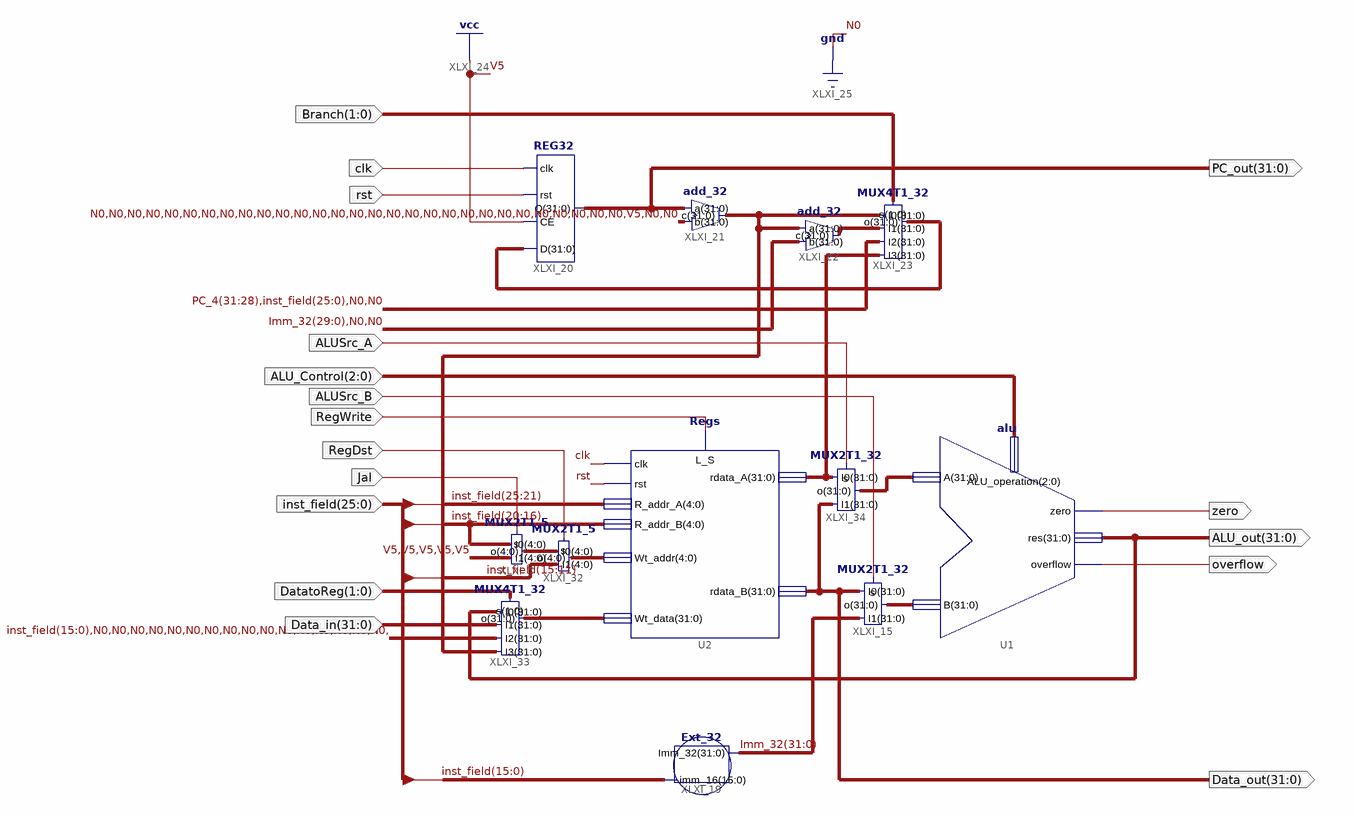
[diagram p0: schematic sheet 1]
// Xilinx ISE schematic Data_path_more.sch (kintex7) as structural Verilog: 12 symbols, 17 ports
module Data_path_more (
  input  [1:0] Branch,
  input  clk,
  input  rst,
  input  [2:0] ALU_Control,
  input  ALUSrc_B,
  input  RegWrite,
  input  Jal,
  input  [1:0] DatatoReg,
  input  [25:0] inst_field,
  input  [31:0] Data_in,
  input  RegDst,
  input  ALUSrc_A,
  output [31:0] PC_out,
  output [31:0] ALU_out,
  output [31:0] Data_out,
  output zero,
  output overflow
);

  wire [4:0] rt, Wt_addr;
  wire [31:0] ALU_A, ALU_B, branch_pc, Imm_32, next_pc, PC_4, rdata_A, WriteDATA;

  REG32 XLXI_20 (.D(next_pc), .CE(1'b1), .rst(rst), .clk(clk), .Q(PC_out));
  add_32 XLXI_21 (.c(PC_4), .a(PC_out), .b(32'b00000000000000000000000000000100));
  MUX4T1_32 XLXI_23 (
    .s(Branch), .I0(PC_4), .I1(branch_pc), .I2({PC_4[31:28], inst_field, 2'b00}), .I3(rdata_A), .o(next_pc));
  add_32 XLXI_22 (.c(branch_pc), .a(PC_4), .b({Imm_32[29:0], 2'b00}));
  alu U1 (.zero(zero), .res(ALU_out), .overflow(overflow), .A(ALU_A), .B(ALU_B), .ALU_operation(ALU_Control));
  Regs U2 (
    .clk(clk), .L_S(RegWrite), .rdata_A(rdata_A), .rst(rst), .Wt_data(WriteDATA), .rdata_B(Data_out),
    .R_addr_A(inst_field[25:21]), .R_addr_B(inst_field[20:16]), .Wt_addr(Wt_addr));
  MUX2T1_32 XLXI_15 (.s(ALUSrc_B), .I0(Data_out), .I1(Imm_32), .o(ALU_B));
  Ext_32 XLXI_19 (.imm_16(inst_field[15:0]), .Imm_32(Imm_32));
  MUX2T1_5 XLXI_3 (.I1({5{1'b1}}), .I0(inst_field[20:16]), .o(rt), .s(Jal));
  MUX2T1_5 XLXI_32 (.I1(inst_field[15:11]), .I0(rt), .o(Wt_addr), .s(RegDst));
  MUX4T1_32 XLXI_33 (
    .s(DatatoReg), .I0(ALU_out), .I1(Data_in), .I2({inst_field[15:0], {16{1'b0}}}), .I3(PC_4), .o(WriteDATA));
  MUX2T1_32 XLXI_34 (.s(ALUSrc_A), .I0(rdata_A), .I1(Data_out), .o(ALU_A));
endmodule
